# EasyEDA Pro project ProProject_AD9833.epro, schematic 子系统
Create Date: 2023-11-12; Page Name: P1; Project Name: 双路AD9833; Schematic Name: 子系统; Update Date: 2023-12-01; Company: 嘉立创EDA; Page Size: A4; Version: V1.0
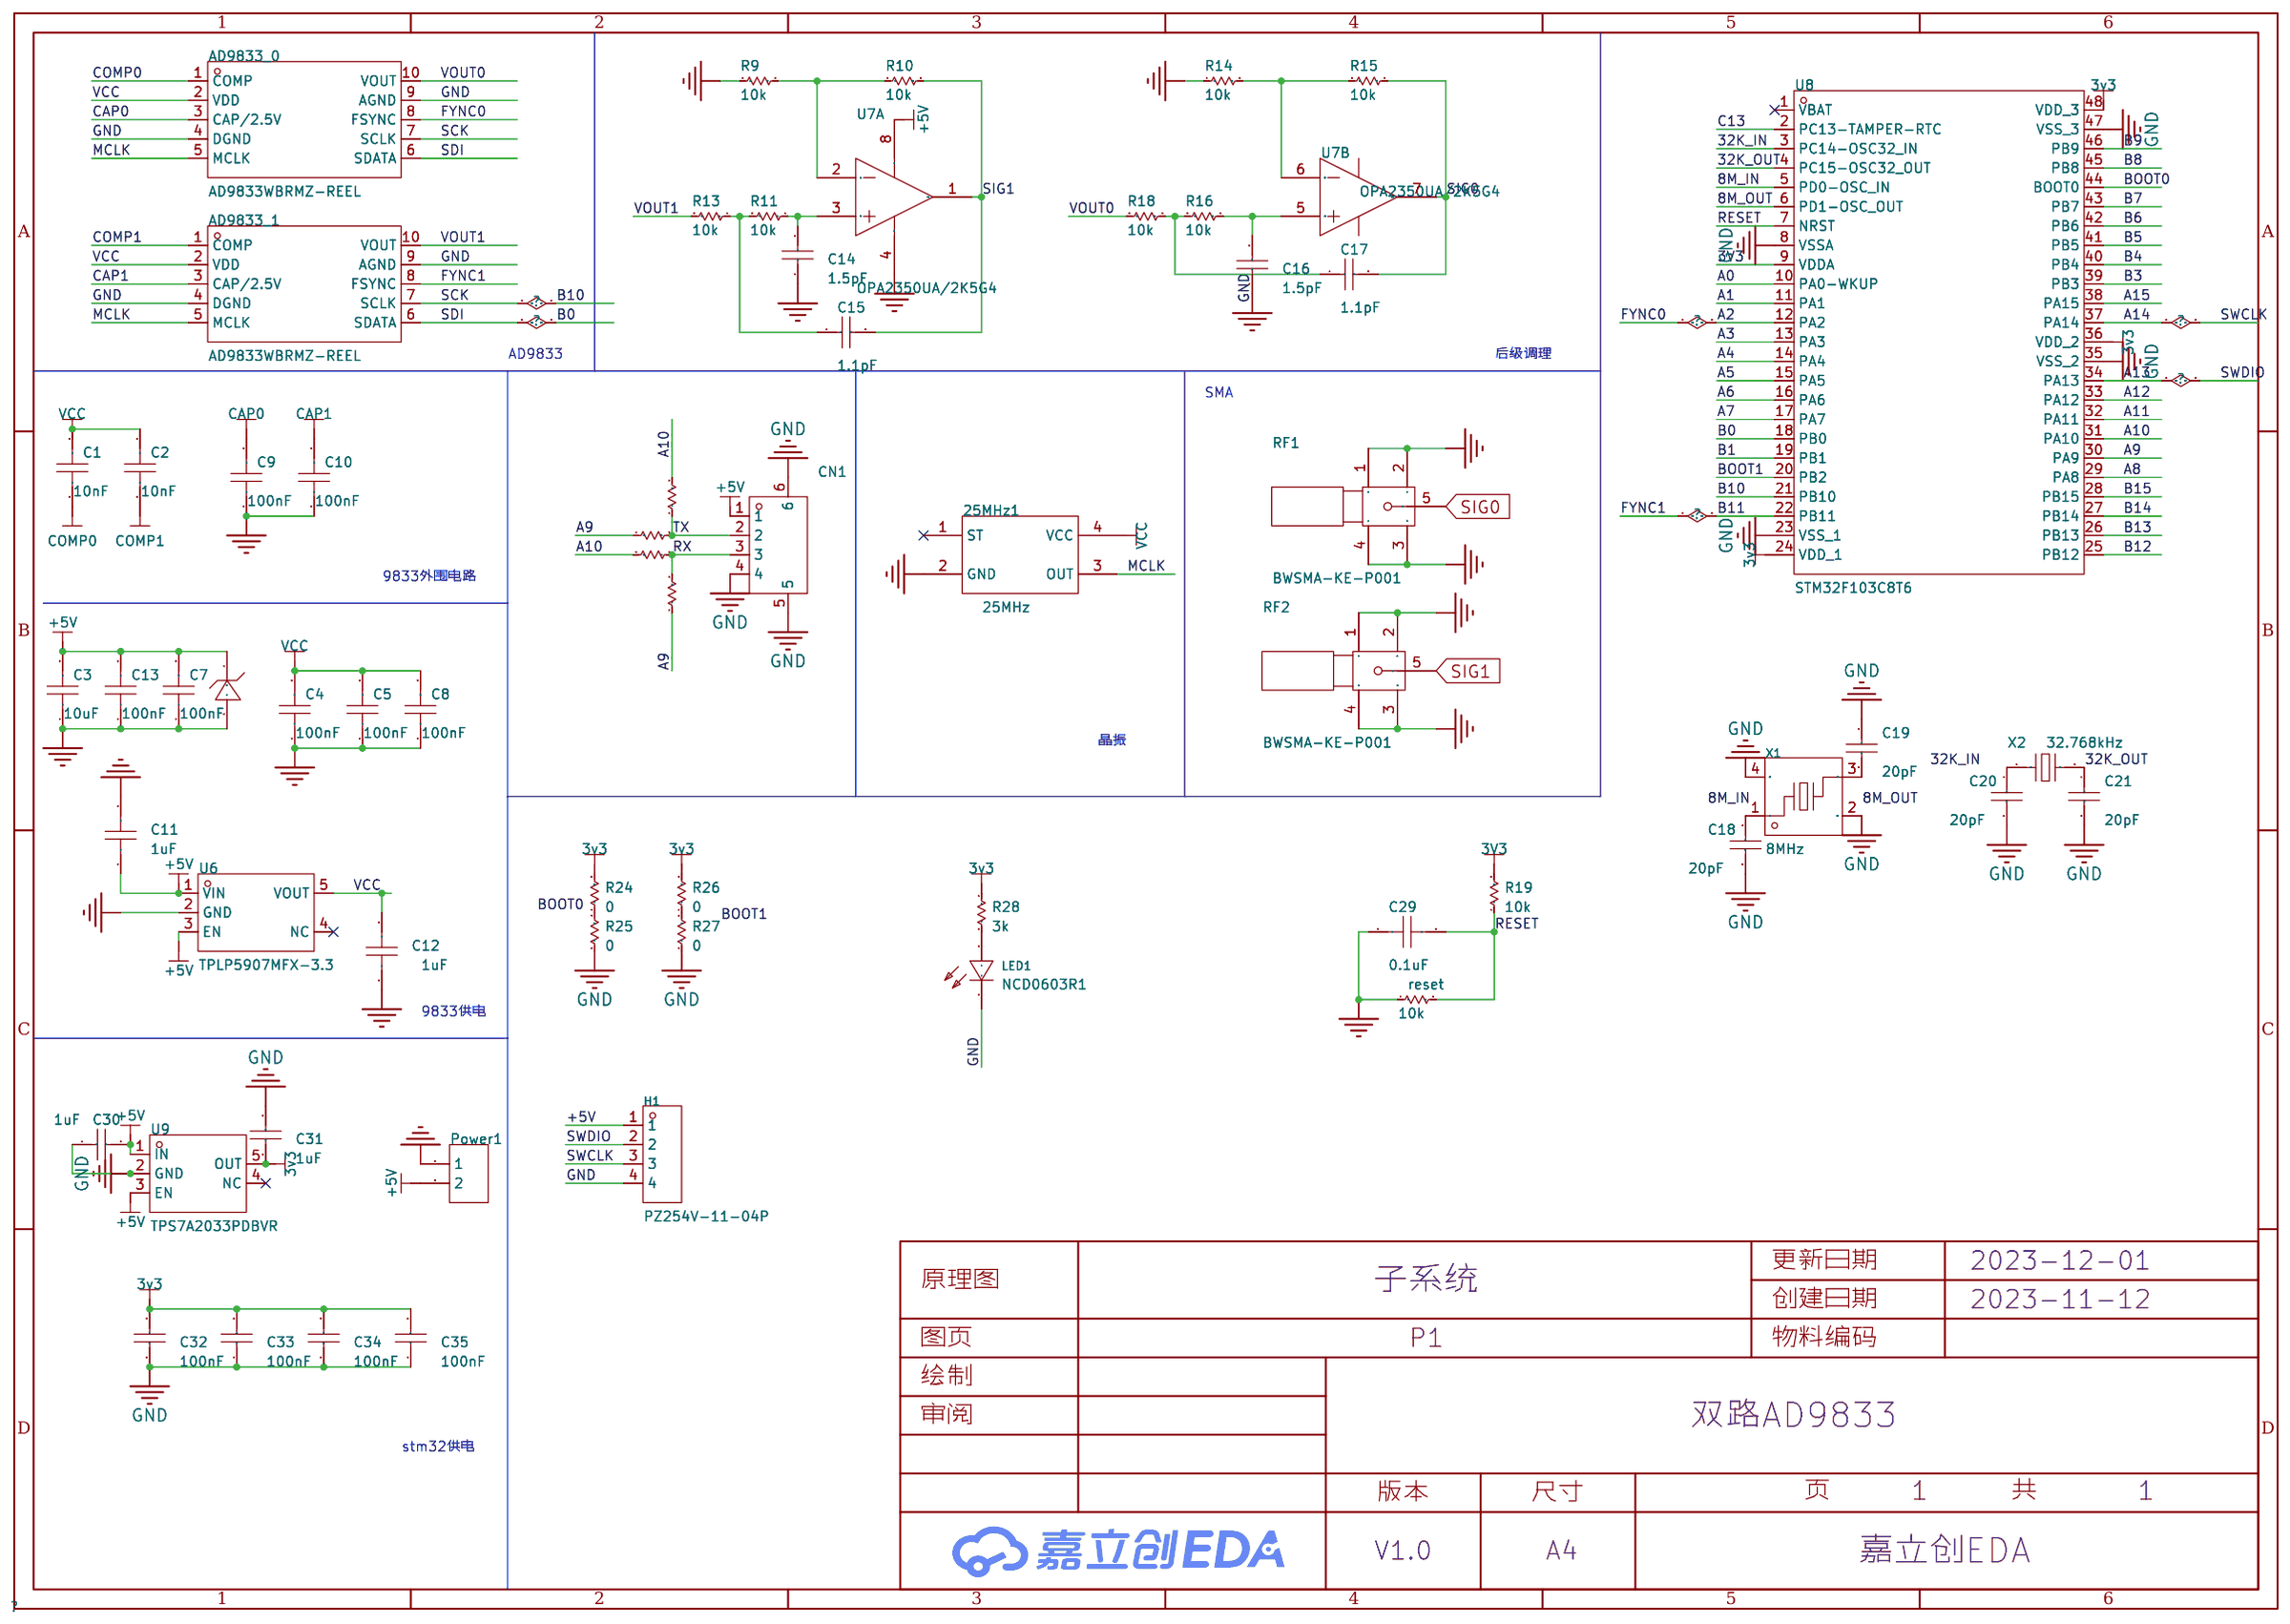
[diagram p1: schematic sheet]

## Parts
25MHz1  25MHz  [OSC-SMD_4P-L3.2-W2.5-BL]
AD9833_0  AD9833WBRMZ-REEL  [MSOP-10_L3.0-W3.0-P0.50-LS5.0-BL]
AD9833_1  AD9833WBRMZ-REEL  [MSOP-10_L3.0-W3.0-P0.50-LS5.0-BL]
C1  10nF  [C0603]
C2  10nF  [C0603]
C3  10uF  [C0603]
C4  100nF  [C0603]
C5  100nF  [C0603]
C7  100nF  [C0603]
C8  100nF  [C0603]
C9  100nF  [C0603]
C10  100nF  [C0603]
C11  1uF  [C0603]
C12  1uF  [C0603]
C13  100nF  [C0603]
C14  1.5pF  [C0603]
C15  1.1pF  [C0603]
C16  1.5pF  [C0603]
C17  1.1pF  [C0603]
C18  20pF  [C0603]
C19  20pF  [C0603]
C20  20pF  [C0603 V1.2]
C21  20pF  [C0603 V1.2]
C29  0.1uF  [c0603]
C30  1uF  [C0603]
C31  1uF  [C0603]
C32  100nF  [C0603]
C33  100nF  [C0603]
C34  100nF  [C0603]
C35  100nF  [C0603 V1.2]
CN1  X8821WRS-04-9TSN  [CONN-SMD_X8821WRS-04-9TSN]
D4  SMBJ5.0A  [SMB_L4.4-W3.6-LS5.3-RD]
H1  PZ254V-11-04P  [HDR-TH_4P-P2.54-V-M]
LED1  NCD0603R1  [LED0603-RD_RED]
Power1  -  [KF2510_2P]
R9  10k  [R0603]
R10  10k  [R0603]
R11  10k  [R0603]
R13  10k  [R0603]
R14  10k  [R0603]
R15  10k  [R0603]
R16  10k  [R0603]
R18  10k  [R0603]
R19  10k  [R0603]
R20  10k  [R0603]
R21  10k  [R0603]
R22  10k  [R0603]
R23  10k  [R0603]
R24  0  [R0603]
R25  0  [R0603]
R26  0  [R0603]
R27  0  [R0603]
R28  3k  [R0603]
reset  10k  [R0603]
RF1  BWSMA-KE-P001  [SMA-SMD_BWSMA-KE-P001]  (no BOM)
RF2  BWSMA-KE-P001  [SMA-SMD_BWSMA-KE-P001]  (no BOM)
U6  TPLP5907MFX-3.3  [SOT-23-5_L2.9-W1.6-P0.95-LS2.8-BR]
U7  OPA2350UA/2K5G4  [SOIC-8_L5.0-W4.0-P1.27-LS6.1-BL]  (sections 1,2)
U8  STM32F103C8T6  [LQFP-48_L7.0-W7.0-P0.50-LS9.0-BL]
U9  TPS7A2033PDBVR  [SOT-23-5_L2.9-W1.6-P0.95-LS2.8-BR]
X1  8MHz  [OSC-SMD_4P-L3.2-W2.5-BL]
X2  32.768kHz  [OSC-SMD_L3.2-W1.5]

## Library data of the parts
25MHz1 = Q33310F70045400: 频率:11.2896MHz;工作电压:3.3V;; LCSC Part Name: 11.2896MHz 3.3V; Supplier Part: C32527; Manufacturer: EPSON(爱普生); Supplier Footprint: SMD3225-4P; JLCPCB Part Class: Extended Part; Datasheet: https://atta.szlcsc.com/upload/public/pdf/source/20161110/1478747426684.pdf; Supplier: LCSC; Supply Voltage: 3.3V; Supply Current (Max): 2.5mA; Operating Temperature: -40℃~+85℃
AD9833_0 AD9833_1 = AD9833WBRMZ-REEL: Supplier Part: C653880; Manufacturer: ADI(亚德诺)/LINEAR; Supplier Footprint: MSOP-10; JLCPCB Part Class: Extended Part; Datasheet: https://atta.szlcsc.com/upload/public/pdf/source/20200901/C653879_C7354661FE492369EE1E91E5EF14B86B.pdf; Supplier: LCSC
C1-C5 C7-C13 C29 = CAP_0402: Supplier Footprint: 0402
C14-C21 C30-C35 = Cap0603
CN1 = X8821WRS-04-9TSN: 参考系列:XH;间距:2.5mm;插针结构:1x4P;排数:1;每排PIN数:4;行距:-;公母:母型插口;安装方式:卧贴;额定电流:3A;触头材质:黄铜;触头镀层:锡;工作温度范围:-25℃~+85℃;焊接温度(最大值):260℃;; LCSC Part Name: 系列:XH 间距:2.5mm 1x4P 卧贴 带耳朵; Supplier Part: C397434; Manufacturer: XKB Connectivity(中国星坤); Supplier Footprint: SMD,P=2.5mm; JLCPCB Part Class: 扩展库; Datasheet: https://atta.szlcsc.com/upload/public/pdf/source/20211009/147B79B22FE81B32D021ABC3AE751292.pdf; Supplier: LCSC; Reference Series: XH; Pitch: 2.5mm; Pins Structure: 1x4P; Number of Rows: 1; Number of PINs Per Row: 4; Gender: 母型插口; Mounting Style: 卧贴; Current Rating (Max): 3A; Contact Material: 黄铜; Contact Plating: 锡; Operating Temperature Range: -25℃~+85℃; Welding Temperature (Max): 260℃
D4 = SMBJ5.0A_C726811: 极性:单向;; LCSC Part Name: 单向; Supplier Part: C726811; Manufacturer: TWGMC(台湾迪嘉); Supplier Footprint: SMB; JLCPCB Part Class: 扩展库; Datasheet: https://atta.szlcsc.com/upload/public/pdf/source/20200901/C726811_07201DC3516E92FF13903A0BAE18F725.pdf; Supplier: LCSC; Polarity: 单向
H1 = PZ254V-11-04P: 排数:单排;总PIN位数:4P;间距:2.54mm;插针结构:1x4P;行距:-;安装类型:直插;圆针/方针:方针;额定电流:3A;额定电压:250V;配合针长度:6mm;塑高:2.5mm;端接针长度:3mm;触头材质:-;工作温度范围:-40℃~+105℃;颜色:黑色;; LCSC Part Name: 2.54mm 1x4P 直插 方针; Supplier Part: C2691448; Manufacturer: XFCN(兴飞); Supplier Footprint: 插件,P=2.54mm; JLCPCB Part Class: Extended Part; Datasheet: https://atta.szlcsc.com/upload/public/pdf/source/20200309/C492403_F9F19131791D08044AD4F84F8E751A34.pdf; Supplier: LCSC; Number of Rows: 单排; Number of Pins: 4P; Pitch: 2.54mm; Pin Structure: 1x4P; Mounting Type: 直插; Circluar Pins/Square Pins: 方针; Current Rating (Max): 3A; Voltage Rating (Max): 250V; Length of Mating Pin: 6mm; Insulation Height: 2.5mm; Length of End Connection Pin: 3mm; Operating Temperature Range: -40℃~+105℃; Color: 黑色
LED1 = NCD0603R1_C84263: 发光颜色:红灯;; LCSC Part Name: 红灯 0603红灯   正贴; Supplier Part: C84263; Manufacturer: 国星光电; Supplier Footprint: 0603; JLCPCB Part Class: Extended Part; Datasheet: https://atta.szlcsc.com/upload/public/pdf/source/20200820/C84263_DABC6A75E58F576973B407FDBA283D60.pdf; Supplier: LCSC; Emitted Color: 红灯
Power1 = KF2510_2P
R9-R11 R13-R16 R18-R28 reset = Res0603
RF1 RF2 = BWSMA-KE-P001: 连接器类型:板端;射频系列:SMA;接口类型:内孔;端口数量:1;阻抗:-;频率-最大值:-;样式:偏脚;接口直径:5.2mm;接口长度/高度:-;工作温度范围:-;; LCSC Part Name: SMA 内孔 偏脚 SMA偏脚板端座子; Supplier Part: C496550; Manufacturer: BAT WIRELESS(蝙蝠无线); Supplier Footprint: 插件; JLCPCB Part Class: Extended Part; Datasheet: https://atta.szlcsc.com/upload/public/pdf/source/20200416/C496550_06668BF2E3B968EA39F96D17E7156373.pdf; Supplier: LCSC; Connector Type: 板端; RF Series: SMA; Interface Type: 内孔; Number of Ports: 1; Style: 偏脚; Interface Diameter: 5.2mm
U6 = TPLP5907MFX-3.3: LCSC Part Name: LP5907MFX-3.3; Supplier Part: C5370990; Manufacturer: TECH PUBLIC(台舟); Supplier Footprint: SOT-23-5; JLCPCB Part Class: Extended Part; Datasheet: https://atta.szlcsc.com/upload/public/pdf/source/20230314/FF2AD341DEE6F9B9360628D995F4E690.pdf; Supplier: LCSC
U7 = OPA2350UA/2K5G4: 双路单电源、轨到轨、高速、低噪声运算放大器 8-SOIC -40 to 85; Supplier Part: C2059575; Manufacturer: TI(德州仪器); Supplier Footprint: SOIC-8; JLCPCB Part Class: 扩展库; Supplier: LCSC
U8 = STM32F103C8T6: CPU内核:ARM Cortex-M3;CPU最大主频:72MHz;工作电压范围:2V~3.6V;程序存储容量:64KB;程序存储器类型:FLASH;RAM总容量:20KB;GPIO端口数量:37;; LCSC Part Name: STM32F103C8T6 MSL=3; Supplier Part: C8734; Manufacturer: ST(意法半导体); Supplier Footprint: LQFP-48(7x7); JLCPCB Part Class: 扩展库; Datasheet: https://atta.szlcsc.com/upload/public/pdf/source/20220812/8363ACEC51AD55ECEB84799464F7CB85.pdf; Supplier: LCSC; CPU Core: ARM Cortex-M3; CPU Maximum Speed: 72MHz; Operating Voltage Range: 2V~3.6V; Program Storage Size: 64KB; Program Memory Type: FLASH; RAM Size: 20KB; GPIO Ports Number: 37; ADC (Bit): 12bit; Universal Serial Bus: 有; Peripheral/Function: 看门狗；DMA；看门狗；片载温度传感器; Watchdog: 有; Infrared Data Association: 有; Low-Voltage Detect: 有; Direct Memory Access: 有; Internal Oscillator: 有; Operating Temperature Range: -40℃~+85℃
U9 = TPS7A2033PDBVR: Supplier Part: C2862740; Manufacturer: TI(德州仪器); Supplier Footprint: SOT-23-5; JLCPCB Part Class: 扩展库; Datasheet: https://atta.szlcsc.com/upload/public/pdf/source/20230221/9B73099824E408F4B24BD95C528A27ED.pdf; Supplier: LCSC
X1 = X32258MOB4SI: 频率:8MHz;频率公差:±10ppm;负载电容:12pF;; LCSC Part Name: 8MHz ±10ppm 12pF YSX321SL; Supplier Part: C2682775; Manufacturer: YXC(扬兴晶振); Supplier Footprint: SMD3225-4P; JLCPCB Part Class: Extended Part; Datasheet: https://atta.szlcsc.com/upload/public/pdf/source/20210106/C2682774_0CD4FDA5D9DA3FBEEC23BD607A48E4B0.pdf; Supplier: LCSC; Crystal Type: 贴片无源晶振; Frequency Tolerance: ±10ppm; Frequency Stability: ±30ppm; Load Capacitance: 12pF; Equivalent Series Resistance (ESR): 150Ω; Operating Temperature: -40℃~+85℃
X2 = X321532768KGD2SI: 频率:32.768kHz;频率公差:±20ppm;负载电容:12.5pF;; LCSC Part Name: 32.768kHz ±20ppm 12.5pF YST310S; Supplier Part: C620155; Manufacturer: YXC(扬兴晶振); Supplier Footprint: SMD3215-2P; JLCPCB Part Class: Extended Part; Datasheet: https://atta.szlcsc.com/upload/public/pdf/source/20210329/C620155_E5A74FC0D27C5E9015A8D75DE9484FEA.pdf; Supplier: LCSC; Crystal Type: 贴片无源晶振; Frequency Tolerance: ±20ppm; Load Capacitance: 12.5pF; Operating Temperature: -40℃~+85℃

## Nets
3V3: R19.2 U8.9(VDDA)
3v3: C31.2 C32.2 C33.2 C34.2 C35.2 R24.2 R26.2 R28.2 U8.24(VDD_1) U8.36(VDD_2) U8.48(VDD_3) U9.5(OUT)
+5V: C3.2 C7.2 C11.1 C13.2 C30.2 CN1.1 D4.1(C) H1.1 Power1.2 U6.1(VIN) U6.3(EN) U7.8(V+) U9.1(IN) U9.3(EN)
GND: 25MHz1.2(GND) AD9833_0.4(DGND) AD9833_0.9(AGND) AD9833_1.4(DGND) AD9833_1.9(AGND) C3.1 C4.1 C5.1 C7.1 C8.1 C9.1 C10.1 C11.2 C12.1 C13.1 C14.1 C16.1 C18.2 C19.1 C20.2 C21.2 C29.1 C30.1 C31.1 C32.1 C33.1 C34.1 C35.1 CN1.4 CN1.5 CN1.6 D4.2(A) H1.4 LED1.1(K) Power1.1 R9.1 R14.1 R25.1 R27.1 reset.1 RF1.1 RF1.2 RF1.3 RF1.4 RF2.1 RF2.2 RF2.3 RF2.4 U6.2(GND) U7.4(V-) U8.8(VSSA) U8.23(VSS_1) U8.35(VSS_2) U8.47(VSS_3) U9.2(GND) X1.2(GND) X1.4(GND)
VCC: 25MHz1.4(VCC) AD9833_0.2(VDD) AD9833_1.2(VDD) C1.1 C2.1 C4.2 C5.2 C8.2 C12.2 U6.5(VOUT)
8M_IN: C18.1 U8.5(PD0-OSC_IN) X1.1
8M_OUT: C19.2 U8.6(PD1-OSC_OUT) X1.3
32K_IN: C20.1 U8.3(PC14-OSC32_IN) X2.1
32K_OUT: C21.1 U8.4(PC15-OSC32_OUT) X2.2
A0: U8.10(PA0-WKUP)
A1: U8.11(PA1)
A2: AD9833_0.8(FSYNC) U8.12(PA2)
A3: U8.13(PA3)
A4: U8.14(PA4)
A5: U8.15(PA5)
A6: U8.16(PA6)
A7: U8.17(PA7)
A8: U8.29(PA8)
A9: R20.1 R23.1 U8.30(PA9)
A10: R21.1 R22.2 U8.31(PA10)
A11: U8.32(PA11)
A12: U8.33(PA12)
A13: H1.2 U8.34(PA13)
A14: H1.3 U8.37(PA14)
A15: U8.38(PA15)
B0: AD9833_0.6(SDATA) AD9833_1.6(SDATA) U8.18(PB0)
B1: U8.19(PB1)
B3: U8.39(PB3)
B4: U8.40(PB4)
B5: U8.41(PB5)
B6: U8.42(PB6)
B7: U8.43(PB7)
B8: U8.45(PB8)
B9: U8.46(PB9)
B10: AD9833_0.7(SCLK) AD9833_1.7(SCLK) U8.21(PB10)
B11: AD9833_1.8(FSYNC) U8.22(PB11)
B12: U8.25(PB12)
B13: U8.26(PB13)
B14: U8.27(PB14)
B15: U8.28(PB15)
BOOT0: R24.1 R25.2 U8.44(BOOT0)
BOOT1: R26.1 R27.2 U8.20(PB2)
C13: U8.2(PC13-TAMPER-RTC)
CAP0: AD9833_0.3(CAP/2.5V) C9.2
CAP1: AD9833_1.3(CAP/2.5V) C10.2
COMP0: AD9833_0.1(COMP) C1.2
COMP1: AD9833_1.1(COMP) C2.2
MCLK: 25MHz1.3(OUT) AD9833_0.5(MCLK) AD9833_1.5(MCLK)
RESET: C29.2 R19.1 reset.2 U8.7(NRST)
RX: CN1.3 R21.2 R23.2
SIG0: C17.2 R15.2 RF1.5 U7.7(OUTB)
SIG1: C15.2 R10.2 RF2.5 U7.1(OUTA)
TX: CN1.2 R20.2 R22.1
VOUT0: AD9833_0.10(VOUT) R18.2
VOUT1: AD9833_1.10(VOUT) R13.2
$1N1456: R9.2 R10.1 U7.2(INA-)
$1N1462: R14.2 R15.1 U7.6(INB-)
$1N1470: C14.2 R11.1 U7.3(INA+)
$1N1471: C15.1 R11.2 R13.1
$1N1472: C16.2 R16.1 U7.5(INB+)
$1N1475: C17.1 R16.2 R18.1
$1N10877: LED1.2(A) R28.1

Not connected (* = marked no-connect by the designer): 25MHz1 1(ST)*; U6 4(NC)*; U8 1(VBAT)*; U9 4(NC)*

## Notes on the sheet
- AD9833
- 后级调理
- SMA
- 9833外围电路
- 晶振
- 9833供电
- stm32供电
